# EAGLE design EEPROM-Programmer (EAGLE 6.5.0)
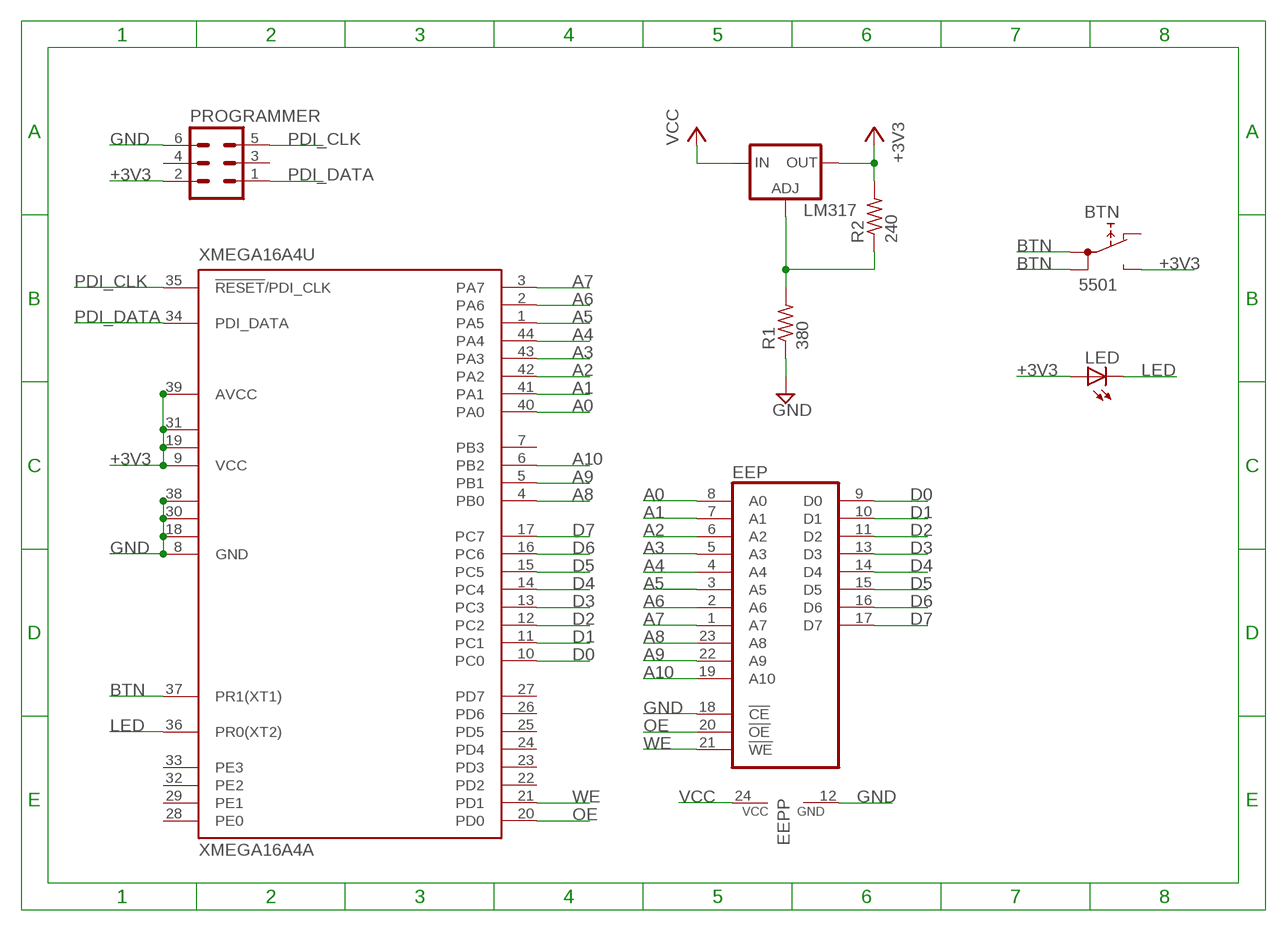
[diagram p0: schematic, sheet 1]

## Parts
BTN  5501  [5501]
EEP  2816  [DIL24]
LED  LED3MM  [LED3MM]
LM317  LM317TS  [317TS]
PROGRAMMER  MA03-2  [MA03-2]
R1  380  R-US_0204/2V  [0204V]
R2  240  R-US_0204/2V  [0204V]
XMEGA16A4U  XMEGA16A4A  [TQFP44]

## Nets
+3V3: BTN.NO LED.A LM317.2(OUT) PROGRAMMER.2 R2.2 XMEGA16A4U.9(VCC) XMEGA16A4U.19(VCC1) XMEGA16A4U.31(VCC2) XMEGA16A4U.39(AVCC)
A0: EEP.8(A0) XMEGA16A4U.40(PA0)
A1: EEP.7(A1) XMEGA16A4U.41(PA1)
A2: EEP.6(A2) XMEGA16A4U.42(PA2)
A3: EEP.5(A3) XMEGA16A4U.43(PA3)
A4: EEP.4(A4) XMEGA16A4U.44(PA4)
A5: EEP.3(A5) XMEGA16A4U.1(PA5)
A6: EEP.2(A6) XMEGA16A4U.2(PA6)
A7: EEP.1(A7) XMEGA16A4U.3(PA7)
A8: EEP.23(A8) XMEGA16A4U.4(PB0)
A9: EEP.22(A9) XMEGA16A4U.5(PB1)
A10: EEP.19(A10) XMEGA16A4U.6(PB2)
BTN: BTN.1A BTN.1B XMEGA16A4U.37(PR1(XT1))
D0: EEP.9(D0) XMEGA16A4U.10(PC0)
D1: EEP.10(D1) XMEGA16A4U.11(PC1)
D2: EEP.11(D2) XMEGA16A4U.12(PC2)
D3: EEP.13(D3) XMEGA16A4U.13(PC3)
D4: EEP.14(D4) XMEGA16A4U.14(PC4)
D5: EEP.15(D5) XMEGA16A4U.15(PC5)
D6: EEP.16(D6) XMEGA16A4U.16(PC6)
D7: EEP.17(D7) XMEGA16A4U.17(PC7)
GND: EEP.12(GND) EEP.18(!CE) PROGRAMMER.6 R1.1 XMEGA16A4U.8(GND) XMEGA16A4U.18(GND1) XMEGA16A4U.30(GND2) XMEGA16A4U.38(GND3)
LED: LED.K(C) XMEGA16A4U.36(PR0(XT2))
N$1: LM317.1(ADJ) R1.2 R2.1
OE: EEP.20(!OE)
PDI_CLK: PROGRAMMER.5 XMEGA16A4U.35(!RESET!/PDI_CLK)
PDI_DATA: PROGRAMMER.1 XMEGA16A4U.34(PDI_DATA)
VCC: EEP.24(VCC) LM317.3(IN)
WE: EEP.21(!WE)
Unconnected: BTN.NC PROGRAMMER.3 PROGRAMMER.4 XMEGA16A4U.7(PB3) XMEGA16A4U.20(PD0) XMEGA16A4U.21(PD1) XMEGA16A4U.22(PD2) XMEGA16A4U.23(PD3) XMEGA16A4U.24(PD4) XMEGA16A4U.25(PD5) XMEGA16A4U.26(PD6) XMEGA16A4U.27(PD7) XMEGA16A4U.28(PE0) XMEGA16A4U.29(PE1) XMEGA16A4U.32(PE2) XMEGA16A4U.33(PE3)

## Library data of the parts
BTN = switch:55?: PUSHBUTTON SERIES 5500 SWITCHES Source: www.e-switch.com .. 5500.pdf
EEP = memory:2816: MEMORY
LED = led:LED: LED OSRAM: - CHIPLED LG R971, LG N971, LY N971, LG Q971, LY Q971, LO R971, LY R971 LH N974, LH R974 LS Q976, LO Q976, LY Q976 LO Q996 - Hyper CHIPLED LW Q18S LB Q993, LB Q99A, LB R99A - SideLED LS A670, LO A670, LY A670, LG A670, LP A670 LB A673, LV A673, LT A673, LW A673 LH A674 LY A675 LS A676, LA A676, LO A676, LY A676, LW A676 LS A679, LY A679, LG A679 - Hyper Micro SIDELED® LS Y876, LA Y876, LO Y876, LY Y876 LT Y87S - SmartLED LW L88C, LW L88S LB L89C, LB L89S, LG L890 LS L89K, LO L89K, LY L89K LS L896, LA L896, LO L896, LY L896 - TOPLED LS T670, LO T670, LY T670, LG T670, LP T670 LSG T670, LSP T670, LSY T670, LOP T670, LYG T670 LG T671, LOG T671, LSG T671 LB T673, LV T673, LT T673, LW T673 LH T674 LS T676, LA T676, LO T676, LY T676, LB T676, LH T676, LSB T676, LW T676 LB T67C, LV T67C, LT T67C, LS T67K, LO T67K, LY T67K, LW E67C LS E67B, LA E67B, LO E67B, LY E67B, LB E67C, LV E67C, LT E67C LW T67C LS T679, LY T679, LG T679 LS T770, LO T770, LY T770, LG T770, LP T770 LB T773, LV T773, LT T773, LW T773 LH T774 LS E675, LA E675, LY E675, LS T675 LS T776, LA T776, LO T776, LY T776, LB T776 LHGB T686 LT T68C, LB T68C - Hyper Mini TOPLED® LB M676 - Mini TOPLED Santana® LG M470 LS M47K, LO M47K, LY M47K Source: http://www.osram.convergy.de LUXEON: - LUMILED® LXK2-PW12-R00, LXK2-PW12-S00, LXK2-PW14-U00, LXK2-PW14-V00 LXK2-PM12-R00, LXK2-PM12-S00, LXK2-PM14-U00 LXK2-PE12-Q00, LXK2-PE12-R00, LXK2-PE12-S00, LXK2-PE14-T00, LXK2-PE14-U00 LXK2-PB12-K00, LXK2-PB12-L00, LXK2-PB12-M00, LXK2-PB14-N00, LXK2-PB14-P00, LXK2-PB14-Q00 LXK2-PR12-L00, LXK2-PR12-M00, LXK2-PR14-Q00, LXK2-PR14-R00 LXK2-PD12-Q00, LXK2-PD12-R00, LXK2-PD12-S00 LXK2-PH12-R00, LXK2-PH12-S00 LXK2-PL12-P00, LXK2-PL12-Q00, LXK2-PL12-R00 Source: www.luxeon.com KINGBRIGHT: KA-3528ASYC Source: www.kingbright.com
LM317 = v-reg:LM317TS: VOLTAGE REGULATOR
PROGRAMMER = con-lstb:MA03-2: PIN HEADER; OC_FARNELL: unknown; OC_NEWARK: unknown
R1 R2 = resistor:R-US_: RESISTOR, American symbol
XMEGA16A4U = atmel:XMEGA16A4: MICROCONTROLLER Features High-performance, Low-power 8/16-bit AVR XMEGA Microcontroller Non-Volatile Program and Data Memories - 16 KB - 128 KB of In-System Self-Programmable Flash - 4 KB - 8 KB Boot Code Section with Independent Lock Bits - 1 KB - 2 KB EEPROM - 2 KB - 8 KB Internal SRAM Peripheral Features - Four-channel DMA Controller with support for external requests - Eight-channel Event System - Five 16-bit Timer/Counters Three Timer/Counters with 4 Output Compare or Input Capture channels Two Timer/Counters with 2 Output Compare or Input Capture channels High-Resolution Extensions on all Timer/Counters Advanced Waveform Extension on one Timer/Counter - Five USARTs IrDA Extension on one USART - Two Two-Wire Interfaces with dual address match (I2C and SMBus compatible) - Two SPIs (Serial Peripheral Interfaces) peripherals - AES and DES Crypto Engine - 16-bit Real Time Counter with Separate Oscillator - One Twelve-channel, 12-bit, 2 Msps Analog to Digital Converter - One Two-channel, 12-bit, 1 Msps Digital to Analog Converter - Two Analog Comparators with Window compare function - External Interrupts on all General Purpose I/O pins - Programmable Watchdog Timer with Separate On-chip Ultra Low Power Oscillator Special Microcontroller Features - Power-on Reset and Programmable Brown-out Detection - Internal and External Clock Options with PLL - Programmable Multi-level Interrupt Controller - Sleep Modes: Idle, Power-down, Standby, Power-save, Extended Standby - Advanced Programming, Test and Debugging Interfaces PDI (Program and Debug Interface) for programming, test and debugging I/O and Packages - 34 Programmable I/O Lines - 44 - lead TQFP - 44 - pad VQFN/QFN - 49 - ball VFBGA Operating Voltage - 1.6 - 3.6V Speed performance - 0 - 12 MHz @ 1.6 - 3.6V - 0 - 32 MHz @ 2.7 - 3.6V Drawn by Dipl.-Ing. (FH) Robert Siegler Created: 27.05.09; OC_FARNELL: unknown; OC_NEWARK: unknown

## Net classes
0 default: clearance 0.205 mm

## Board
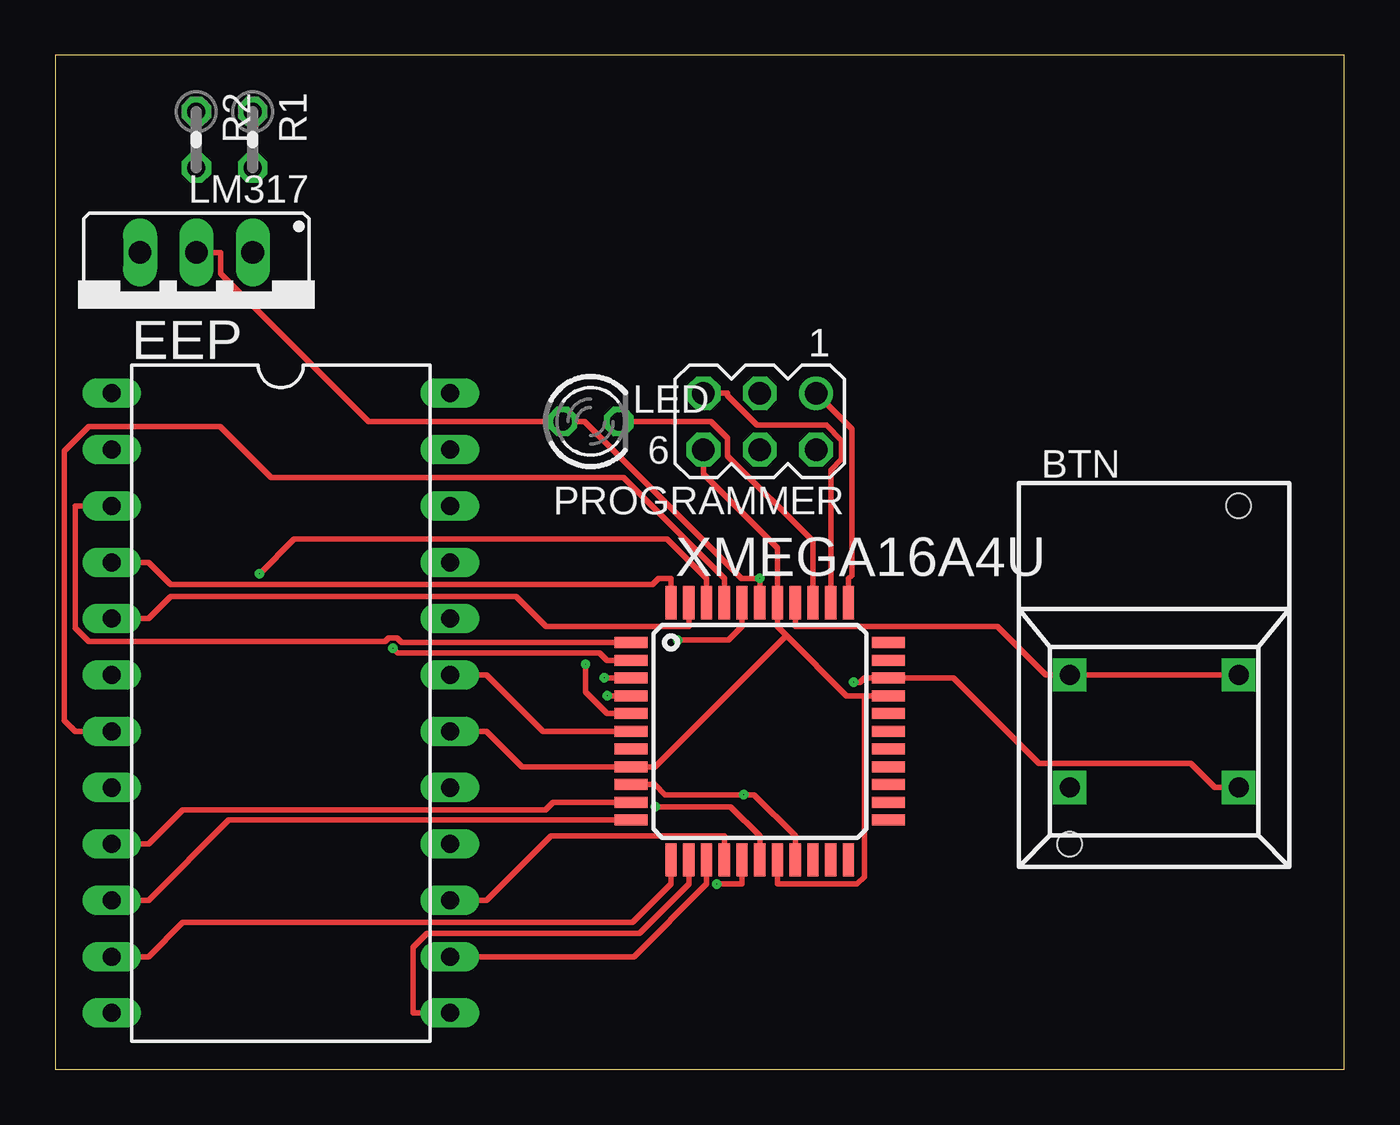
[diagram p1: board, top side]
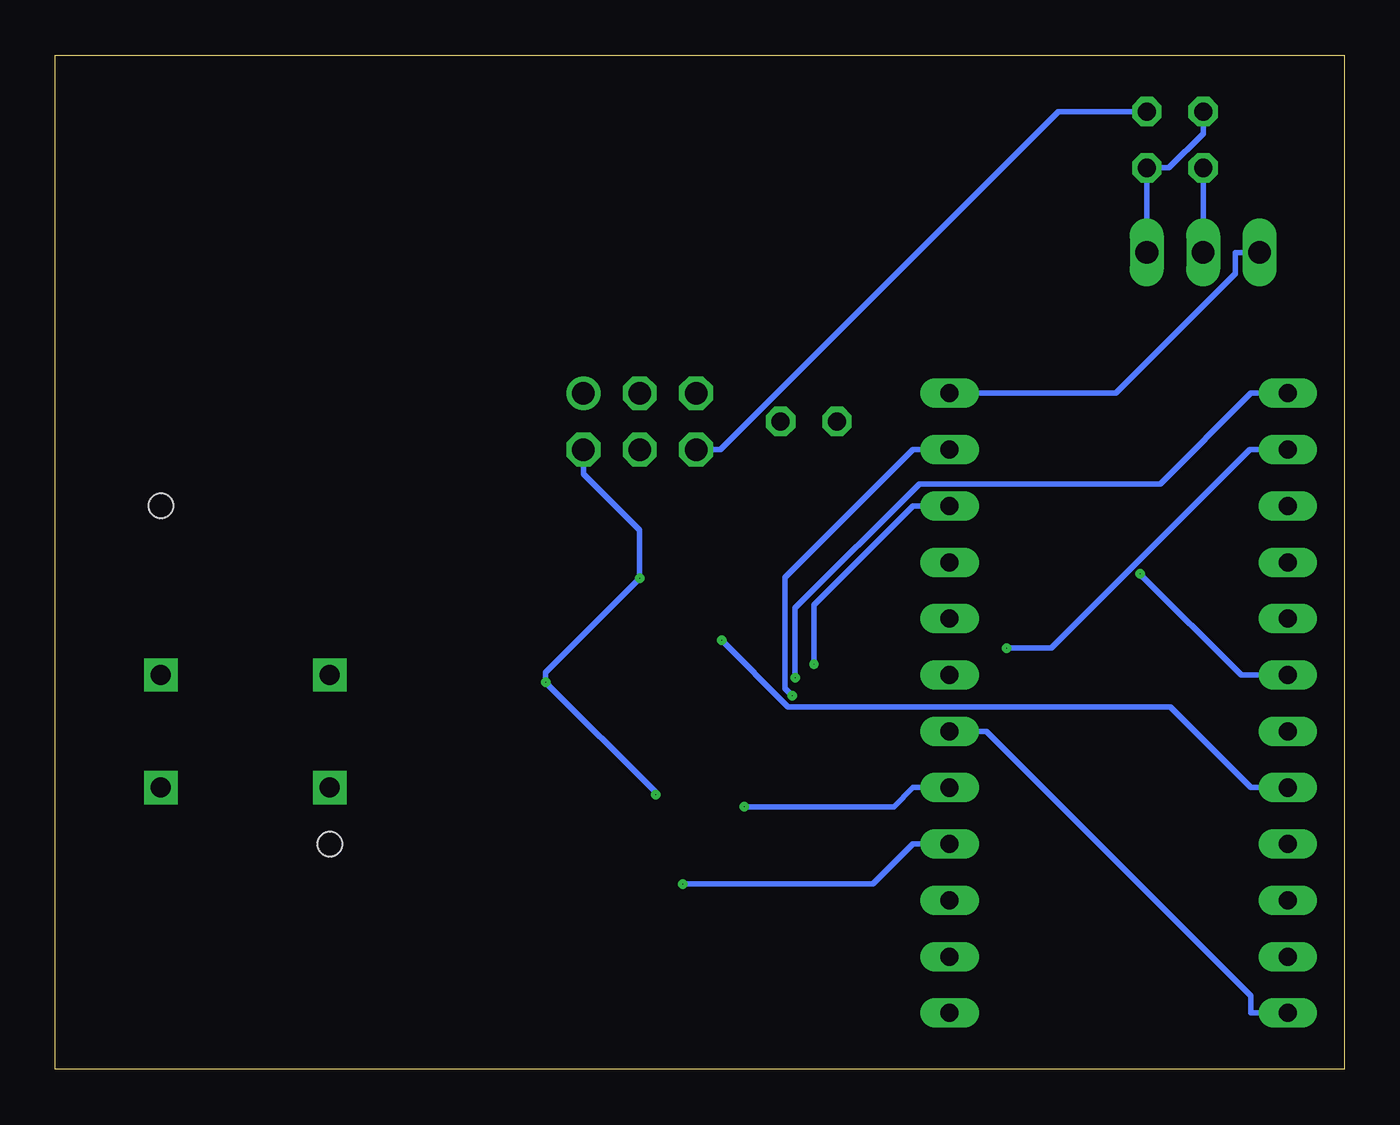
[diagram p2: board, bottom side, seen from below]

Size 58.09 x 45.71 mm. Coordinates in mm from the lower left corner, seen from the top.
Outline: 0,0 58.09,0 58.09,45.71 0,45.71 0,0
Copper layers (1*16): Top 0.035mm / dielectric 1.5mm / Bottom 0.035mm
Design rules "default": minimum track width 10mil, minimum drill 24mil, track to track 8mil, track to pad 8mil, pad to pad 8mil, via to via 8mil, smd to smd 8mil, copper to edge 40mil, drill to drill 8mil, minimum pad ring 10mil, minimum via ring 8mil, stop-mask expansion 4mil, vias tented up to drill 0mil, thermal gap 10mil

### Footprints (pad centres in the part's own frame; a part is rotated, then mirrored left to right if it is on the bottom)
5501 = drill 0.9 pad 1.5 square: 1A 0,3.81; 1B 0,-3.81; NC 5.08,-3.81; NO 5.08,3.81 | hole 1.1: -7.62,3.81; 7.62,-3.81
DIL24 = drill 0.813 long: 1 -13.97,-7.62; 2 -11.43,-7.62; 3 -8.89,-7.62; 4 -6.35,-7.62; 5 -3.81,-7.62; 6 -1.27,-7.62; 7 1.27,-7.62; 8 3.81,-7.62; 9 6.35,-7.62; 10 8.89,-7.62; 11 11.43,-7.62; 12 13.97,-7.62; 13 13.97,7.62; 14 11.43,7.62; 15 8.89,7.62; 16 6.35,7.62; 17 3.81,7.62; 18 1.27,7.62; 19 -1.27,7.62; 20 -3.81,7.62; 21 -6.35,7.62; 22 -8.89,7.62; 23 -11.43,7.62; 24 -13.97,7.62
LED3MM = drill 0.813 octagon: A -1.27,0; K 1.27,0
317TS = drill 1.016 long: 1 -2.54,-2.54; 2 0,-2.54; 3 2.54,-2.54
MA03-2 = drill 1.016: 1 -2.54,-1.27 | drill 1.016 octagon: 2 -2.54,1.27; 3 0,-1.27; 4 0,1.27; 5 2.54,-1.27; 6 2.54,1.27
0204V = drill 0.813 octagon: 1 -1.27,0; 2 1.27,0
TQFP44 = smd 1.5 x 0.5: 1 -5.8,4; 2 -5.8,3.2; 3 -5.8,2.4; 4 -5.8,1.6; 5 -5.8,0.8; 6 -5.8,0; 7 -5.8,-0.8; 8 -5.8,-1.6; 9 -5.8,-2.4; 10 -5.8,-3.2; 11 -5.8,-4; 23 5.8,-4; 24 5.8,-3.2; 25 5.8,-2.4; 26 5.8,-1.6; 27 5.8,-0.8; 28 5.8,0; 29 5.8,0.8; 30 5.8,1.6; 31 5.8,2.4; 32 5.8,3.2; 33 5.8,4 | smd 0.5 x 1.5: 12 -4,-5.8; 13 -3.2,-5.8; 14 -2.4,-5.8; 15 -1.6,-5.8; 16 -0.8,-5.8; 17 0,-5.8; 18 0.8,-5.8; 19 1.6,-5.8; 20 2.4,-5.8; 21 3.2,-5.8; 22 4,-5.8; 34 4,5.8; 35 3.2,5.8; 36 2.4,5.8; 37 1.6,5.8; 38 0.8,5.8; 39 0,5.8; 40 -0.8,5.8; 41 -1.6,5.8; 42 -2.4,5.8; 43 -3.2,5.8; 44 -4,5.8

### Placement (x,y rotation side)
BTN  49.53,17.78 270 top
EEP  10.16,16.51 270 top
LED  24.13,29.21 0 top
LM317  6.35,34.29 180 top
PROGRAMMER  31.75,29.21 180 top
R1  8.89,41.91 270 top
R2  6.35,41.91 270 top
XMEGA16A4U  31.75,15.24 0 top

### Tracks (layer width: path | path; a pad name or v marks a point on that pad's centre or on a via)
+3V3  (via drill 0.02 pad 0.03)
  Top 0.254: v35.99,17.45 36.28,17.45 36.47,17.64 XMEGA16A4U.31 40.49,17.64 44.34,13.78 51.18,13.78 52.26,12.7 BTN.NO | XMEGA16A4U.39 31.75,21.52 31.75,22.01 v31.75,22.14 30.93,22.14 23.85,29.21 LED.A 21.87,29.21 14.11,29.21 7.44,35.87 7.44,36.83 LM317.2 | XMEGA16A4U.19 33.35,10.52 31.49,12.38 v31.03,12.38 27.49,12.38 27.03,12.84 XMEGA16A4U.9
  Bottom 0.254: v31.03,12.38 31.03,12.48 v35.99,17.45 35.99,17.89 v31.75,22.14 31.75,24.31 34.29,26.85 PROGRAMMER.2 | LM317.2 R2.2
A0  (via drill 0.02 pad 0.03)
  Top 0.254: XMEGA16A4U.40 30.95,19.96 30.34,19.35 v28.06,19.35
  Bottom 0.254: EEP.8 4.19,12.7 7.84,16.35 25.06,16.35 v28.06,19.35
A1
  Top 0.254: EEP.7 0.89,15.24 0.39,15.74 0.39,27.87 1.5,28.98 7.42,28.98 9.73,26.67 25.6,26.67 30.15,22.12 XMEGA16A4U.41
A2  (via drill 0.02 pad 0.03)
  Top 0.254: XMEGA16A4U.42 29.35,22.12 27.57,23.91 10.77,23.91 v9.2,22.34
  Bottom 0.254: v9.2,22.34 4.64,17.78 EEP.6
A3
  Top 0.254: EEP.5 4.19,20.32 5.19,21.32 20.76,21.32 22.12,19.96 28.55,19.96 XMEGA16A4U.43
A4
  Top 0.254: EEP.4 4.19,22.86 5.18,21.87 26.92,21.87 27.18,22.12 27.75,22.12 XMEGA16A4U.44
A5
  Top 0.254: XMEGA16A4U.1 15.61,19.24 15.4,19.45 15.02,19.45 14.87,19.29 1.49,19.29 0.89,19.89 0.89,25.4 EEP.3
A6  (via drill 0.02 pad 0.03)
  Top 0.254: XMEGA16A4U.2 24.87,18.44 24.53,18.78 15.42,18.78 v15.21,18.99
  Bottom 0.254: v15.21,18.99 13.2,18.99 4.25,27.94 4.19,27.94 EEP.2
A7  (via drill 0.02 pad 0.03)
  Top 0.254: v24.75,17.66 24.84,17.66 24.87,17.64 XMEGA16A4U.3
  Bottom 0.254: v24.75,17.66 24.75,20.8 19.15,26.39 8.28,26.39 4.19,30.48 EEP.1
A8  (via drill 0.02 pad 0.03)
  Top 0.254: XMEGA16A4U.4 v24.87,16.84
  Bottom 0.254: v24.87,16.84 25.2,17.18 25.2,22.17 19.43,27.94 EEP.23
A9  (via drill 0.02 pad 0.03)
  Top 0.254: XMEGA16A4U.5 24.87,16.04 23.89,17.01 v23.89,18.26
  Bottom 0.254: EEP.22 19.43,25.4 23.89,20.94 v23.89,18.26
A10
  Top 0.254: EEP.19 19.43,17.78 21.97,15.24 XMEGA16A4U.6
BTN
  Top 0.254: XMEGA16A4U.37 33.35,19.96 42.46,19.96 44.64,17.78 BTN.1B BTN.1A
D0
  Top 0.254: EEP.9 4.19,10.16 5.74,11.71 22.1,11.71 22.43,12.04 XMEGA16A4U.10
D1
  Top 0.254: XMEGA16A4U.11 7.81,11.24 4.19,7.62 EEP.10
D2
  Top 0.254: EEP.11 4.19,5.08 5.74,6.63 26.02,6.63 27.75,8.36 XMEGA16A4U.12
D3
  Top 0.254: EEP.13 16.13,2.54 16.13,5.5 16.76,6.13 26.32,6.13 28.55,8.36 XMEGA16A4U.13
D4
  Top 0.254: XMEGA16A4U.14 29.35,8.36 26.07,5.08 EEP.14
D5
  Top 0.254: EEP.15 19.43,7.62 22.34,10.52 30.15,10.52 XMEGA16A4U.15
D6  (via drill 0.02 pad 0.03)
  Top 0.254: v29.81,8.36 30.95,8.36 XMEGA16A4U.16
  Bottom 0.254: v29.81,8.36 21.23,8.36 19.43,10.16 EEP.16
D7  (via drill 0.02 pad 0.03)
  Top 0.254: v27.03,11.84 30.43,11.84 31.75,10.52 XMEGA16A4U.17
  Bottom 0.254: v27.03,11.84 20.3,11.84 19.43,12.7 EEP.17
GND
  Top 0.254: 32.95,19.56 35.67,16.84 36.47,16.84 | 32.95,19.56 32.55,19.96 XMEGA16A4U.38 32.55,23.51 29.21,26.85 PROGRAMMER.6 | 32.95,19.56 27.03,13.64 XMEGA16A4U.8 21.03,13.64 19.43,15.24 EEP.18 | XMEGA16A4U.18 32.55,8.36 36.14,8.36 36.47,8.68 36.47,16.84 | XMEGA16A4U.30 36.47,16.84
  Bottom 0.254: PROGRAMMER.6 28.12,27.94 12.88,43.18 R1.1 | EEP.12 4.19,2.54 4.19,3.31 16.13,15.24 EEP.18
LED
  Top 0.254: XMEGA16A4U.36 34.15,23.81 30.3,27.66 30.3,28.45 29.54,29.21 LED.K
N$1
  Bottom 0.254: 8.39,40.64 8.89,40.14 LM317.1 | 8.39,40.64 7.9,40.64 6.35,42.19 R2.1 | R1.2 8.39,40.64
PDI_CLK
  Top 0.254: PROGRAMMER.5 30.3,30.48 30.3,30.37 31.62,29.05 34.75,29.05 35.44,28.36 35.44,27.51 34.95,27.03 XMEGA16A4U.35
PDI_DATA
  Top 0.254: XMEGA16A4U.34 35.75,22.12 35.9,22.28 35.9,28.87 PROGRAMMER.1
VCC
  Bottom 0.254: LM317.3 4.9,36.83 4.9,35.87 10.3,30.48 EEP.24